# EAGLE design Boot_selector_SMD (EAGLE 7.7.0)
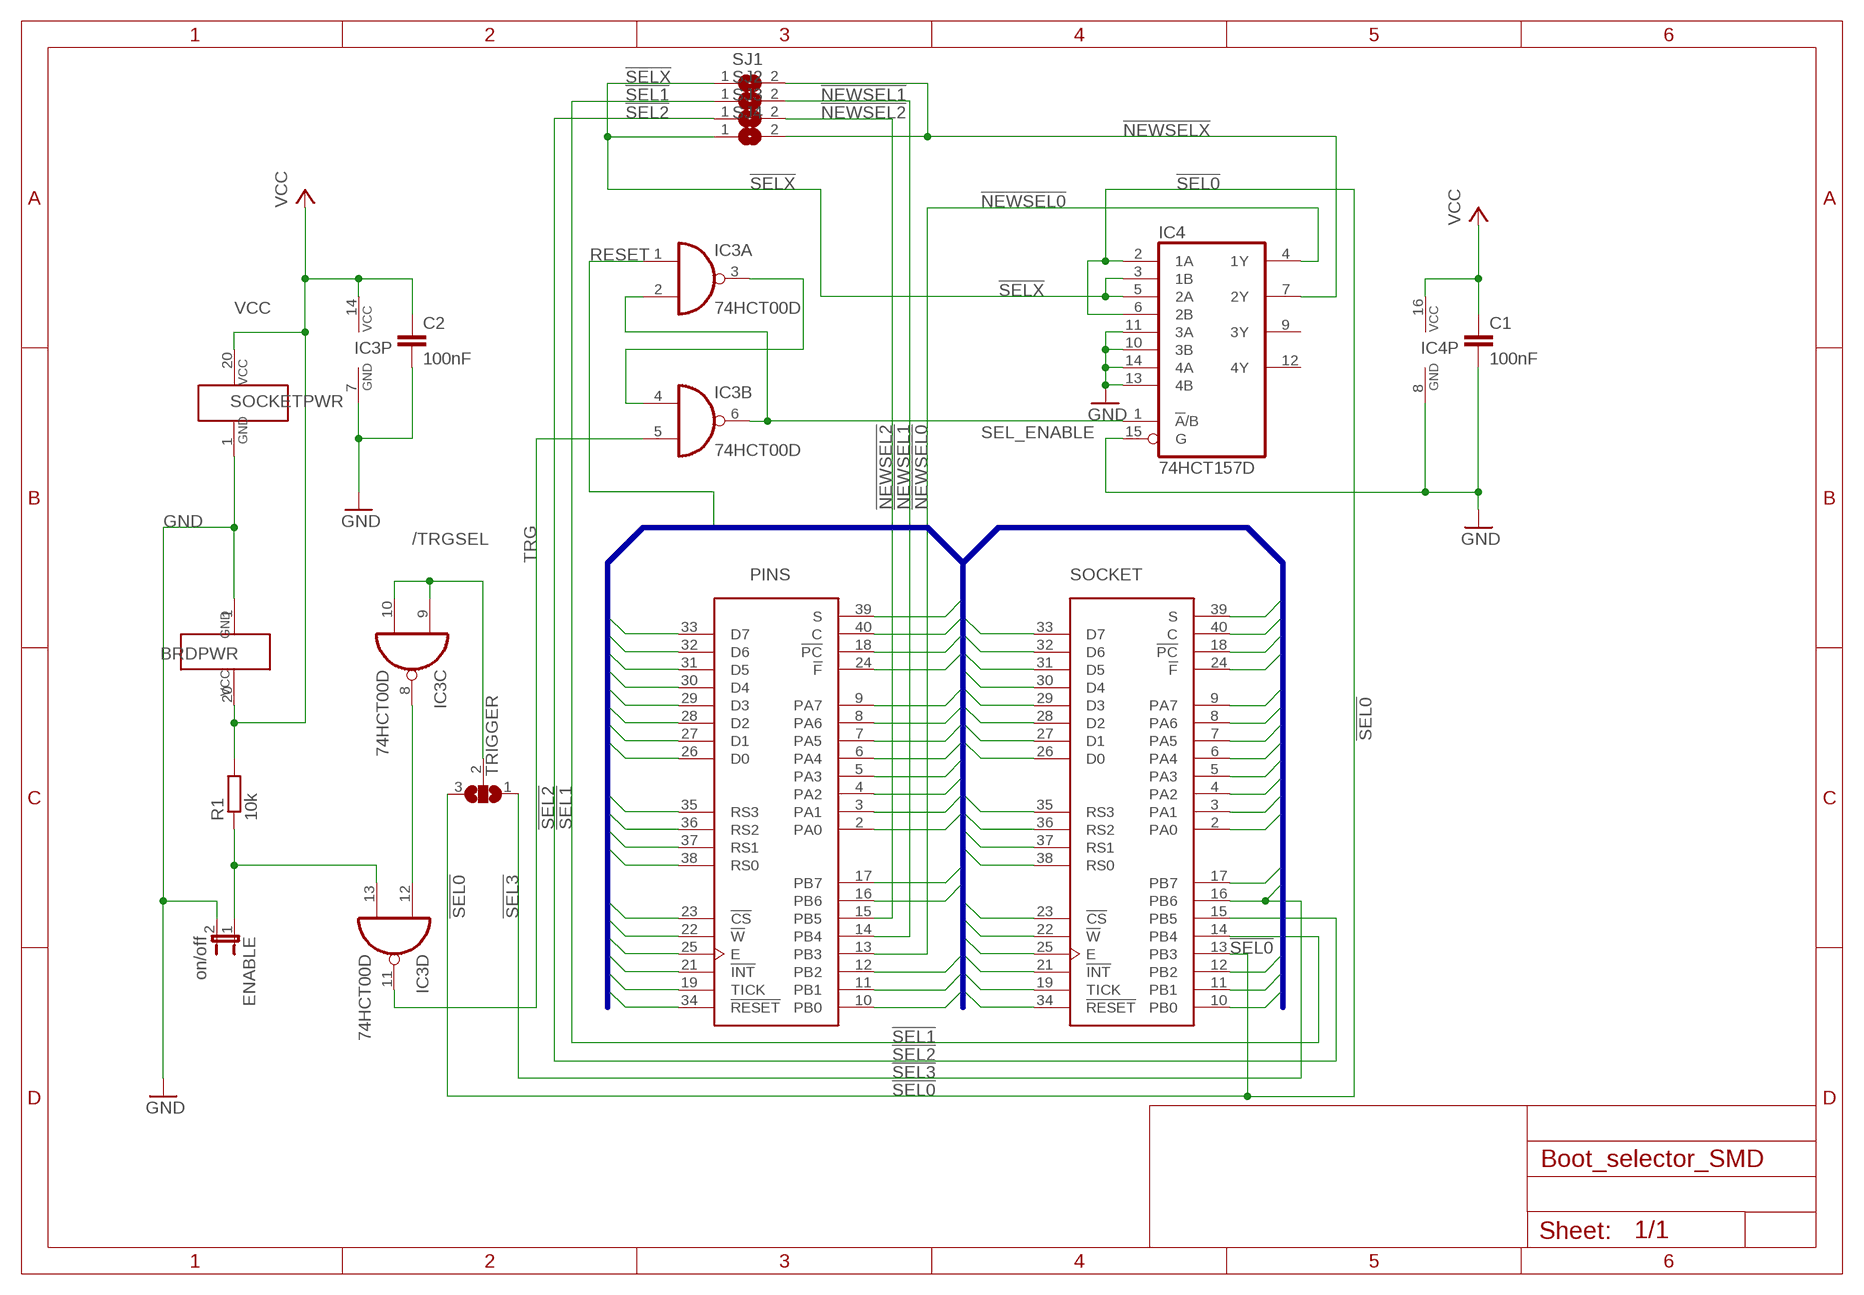
[diagram p0: schematic, sheet 1]

## Parts
BRD  PINS  CIA_DIP  [DIP40-6]
C1  100nF  C-EUC0805  [C0805]
C2  100nF  C-EUC0805K  [C0805K]
ENABLE  on/off  JP1E  [JP1]
IC3  74HCT00D  [SO14]
IC4  74HCT157D  [SO16]
R1  10k  R-EU_R0805  [R0805]
SJ1  SJ  [SJ]
SJ2  SJ  [SJ]
SJ3  SJ  [SJ]
SJ4  SJ  [SJ]
SOCKET  CIA_DIP  [DIP40-6]
TRIGGER  SJ2W  [SJ_2]

## Nets
!NEWSEL0: BRD.13(PB3) IC4.4(1Y)
!NEWSEL1: BRD.14(PB4) SJ2.2
!NEWSEL2: BRD.15(PB5) SJ3.2
!NEWSELX: IC4.7(2Y) SJ1.2 SJ4.2
!SEL0: IC4.2(1A) IC4.6(2B) SOCKET.13(PB3) TRIGGER.3
!SEL1: SJ2.1 SOCKET.14(PB4)
!SEL2: SJ3.1 SOCKET.15(PB5)
!SEL3: BRD.16(PB6) SOCKET.16(PB6) TRIGGER.1
!SELX: IC4.3(1B) IC4.5(2A) SJ1.1 SJ4.1
/TRGSEL: IC3.9(C:I0) IC3.10(C:I1) TRIGGER.2
C: BRD.40(C) SOCKET.40(C)
CS: BRD.23(!CS) SOCKET.23(!CS)
D0: BRD.26(D0) SOCKET.26(D0)
D1: BRD.27(D1) SOCKET.27(D1)
D2: BRD.28(D2) SOCKET.28(D2)
D3: BRD.29(D3) SOCKET.29(D3)
D4: BRD.30(D4) SOCKET.30(D4)
D5: BRD.31(D5) SOCKET.31(D5)
D6: BRD.32(D6) SOCKET.32(D6)
D7: BRD.33(D7) SOCKET.33(D7)
E: BRD.25(E) SOCKET.25(E)
F: BRD.24(!F) SOCKET.24(!F)
GND: BRD.1(GND1) C1.2 C2.2 ENABLE.2 IC3.7(P:GND) IC4.8(GND) IC4.10(3B) IC4.11(3A) IC4.13(4B) IC4.14(4A) IC4.15(G) SOCKET.1(GND1)
INT: BRD.21(!INT) SOCKET.21(!INT)
N$2: ENABLE.1 IC3.13(D:I1) R1.1
N$4: IC3.8(C:O) IC3.12(D:I0)
N$6: IC3.3(A:O) IC3.4(B:I0)
PA0: BRD.2(PA0) SOCKET.2(PA0)
PA1: BRD.3(PA1) SOCKET.3(PA1)
PA2: BRD.4(PA2) SOCKET.4(PA2)
PA3: BRD.5(PA3) SOCKET.5(PA3)
PA4: BRD.6(PA4) SOCKET.6(PA4)
PA5: BRD.7(PA5) SOCKET.7(PA5)
PA6: BRD.8(PA6) SOCKET.8(PA6)
PA7: BRD.9(PA7) SOCKET.9(PA7)
PB0: BRD.10(PB0) SOCKET.10(PB0)
PB1: BRD.11(PB1) SOCKET.11(PB1)
PB2: BRD.12(PB2) SOCKET.12(PB2)
PB7: BRD.17(PB7) SOCKET.17(PB7)
PC: BRD.18(!PC) SOCKET.18(!PC)
RESET: BRD.34(!RESET) IC3.1(A:I0) SOCKET.34(!RESET)
RS0: BRD.38(RS0) SOCKET.38(RS0)
RS1: BRD.37(RS1) SOCKET.37(RS1)
RS2: BRD.36(RS2) SOCKET.36(RS2)
RS3: BRD.35(RS3) SOCKET.35(RS3)
S: BRD.39(S) SOCKET.39(S)
SEL_ENABLE: IC3.2(A:I1) IC3.6(B:O) IC4.1(!A!/B)
TICK: BRD.19(TICK) SOCKET.19(TICK)
TRG: IC3.5(B:I1) IC3.11(D:O)
VCC: BRD.20(VCC1) C1.1 C2.1 IC3.14(P:VCC) IC4.16(VCC) R1.2 SOCKET.20(VCC1)
W: BRD.22(!W) SOCKET.22(!W)
Unconnected: IC4.9(3Y) IC4.12(4Y)

## Buses
!SEL3,D[0..7],PA[0..7],PB[0..2],PB[5..7],F,PC,C,S,RS[0..3],CS,W,E,INT,TICK,RESET

## Library data of the parts
BRD SOCKET = Amiga:CIA
C1 C2 = rcl:C-EU: CAPACITOR, European symbol
ENABLE = jumper:JP1E: JUMPER
IC3 = 74xx-eu:74*00: Quad 2-input NAND gate
IC4 = 74xx-eu:74*157: Quadruple 2-line to 1-line data SELECTOR/MULTIPLEXER
R1 = rcl:R-EU_: RESISTOR, European symbol
SJ1-SJ4 = jumper:SJ: SMD solder JUMPER
TRIGGER = jumper:SJ2W: SMD solder JUMPER

## Board
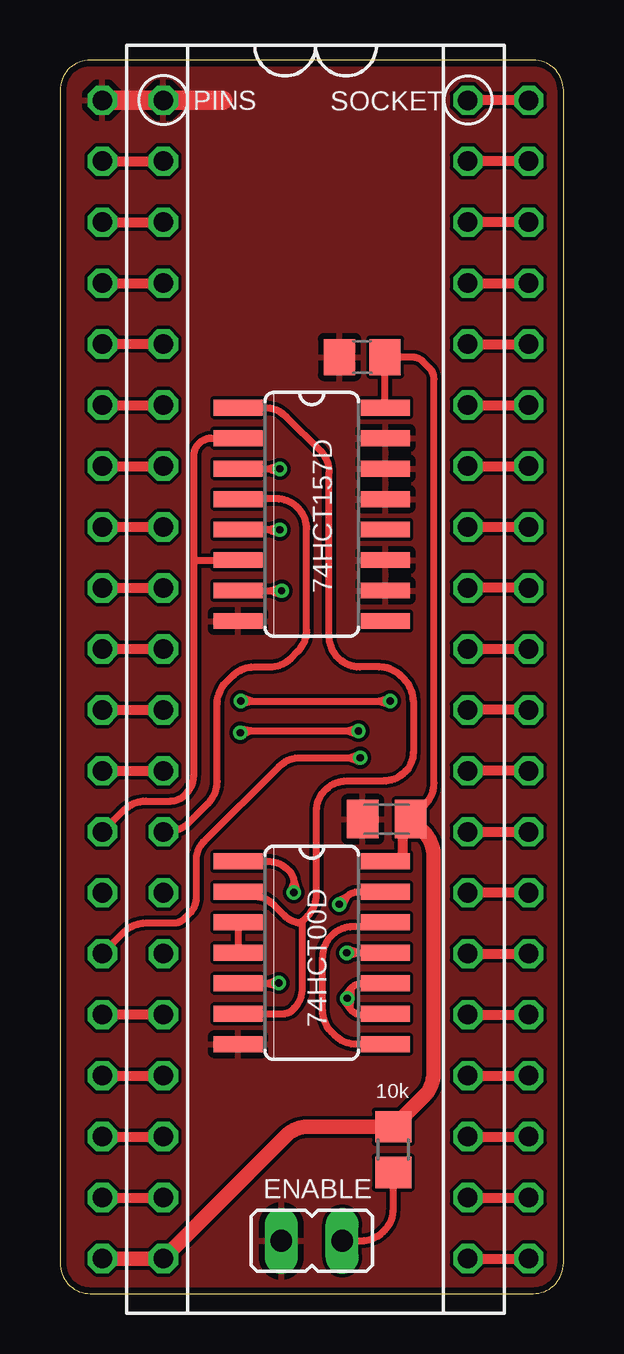
[diagram p1: board, top side]
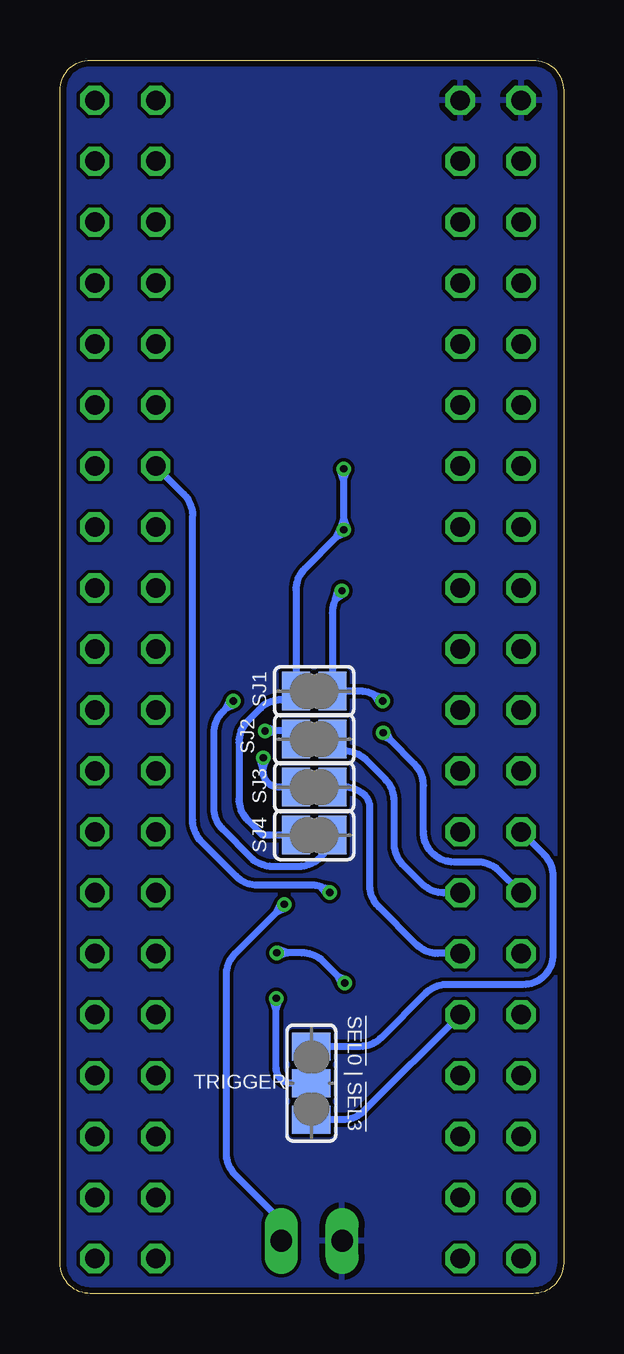
[diagram p2: board, bottom side, seen from below]

Size 21 x 51.4 mm. Coordinates in mm from the lower left corner, seen from the top.
Outline: 0,50.13 0,1.27 arc90 1.27,0 19.73,0 arc90 21,1.27 21,50.13 arc90 19.73,51.4 1.27,51.4 arc90 0,50.13
Copper layers (1*16): Top 0.0356mm / dielectric 1.5011mm / Bottom 0.0356mm
Design rules "Cogra_utvecklarservice *": minimum track width 0.15mm, minimum drill 0.3mm, track to track 0.15mm, track to pad 0.15mm, pad to pad 0.15mm, via to via 0.15mm, smd to smd 0.15mm, copper to edge 10mil, drill to drill 0.5mm, minimum pad ring 0.15mm, minimum via ring 0.15mm, stop-mask expansion 0mil, vias tented up to drill 15mil, thermal gap 10mil

### Footprints (pad centres in the part's own frame; a part is rotated, then mirrored left to right if it is on the bottom)
DIP40-6 = drill 0.813 octagon: 1 -24.13,-7.62; 2 -21.59,-7.62; 3 -19.05,-7.62; 4 -16.51,-7.62; 5 -13.97,-7.62; 6 -11.43,-7.62; 7 -8.89,-7.62; 8 -6.35,-7.62; 9 -3.81,-7.62; 10 -1.27,-7.62; 11 1.27,-7.62; 12 3.81,-7.62; 13 6.35,-7.62; 14 8.89,-7.62; 15 11.43,-7.62; 16 13.97,-7.62; 17 16.51,-7.62; 18 19.05,-7.62; 19 21.59,-7.62; 20 24.13,-7.62; 21 24.13,7.62; 22 21.59,7.62; 23 19.05,7.62; 24 16.51,7.62; 25 13.97,7.62; 26 11.43,7.62; 27 8.89,7.62; 28 6.35,7.62; 29 3.81,7.62; 30 1.27,7.62; 31 -1.27,7.62; 32 -3.81,7.62; 33 -6.35,7.62; 34 -8.89,7.62; 35 -11.43,7.62; 36 -13.97,7.62; 37 -16.51,7.62; 38 -19.05,7.62; 39 -21.59,7.62; 40 -24.13,7.62
C0805 = smd 1.3 x 1.5: 1 -0.95,0; 2 0.95,0
C0805K = smd 1.3 x 1.6: 1 -1,0; 2 1,0
JP1 = drill 0.914 long: 1 0,-1.27; 2 0,1.27
SO14 = smd 0.66 x 2.032: 1 -3.81,-3.073; 2 -2.54,-3.073; 3 -1.27,-3.073; 4 0,-3.073; 5 1.27,-3.073; 6 2.54,-3.073; 7 3.81,-3.073; 8 3.81,3.073; 9 2.54,3.073; 10 1.27,3.073; 11 0,3.073; 12 -1.27,3.073; 13 -2.54,3.073; 14 -3.81,3.073
SO16 = smd 0.66 x 2.032: 1 -4.445,-3.073; 2 -3.175,-3.073; 3 -1.905,-3.073; 4 -0.635,-3.073; 5 0.635,-3.073; 6 1.905,-3.073; 7 3.175,-3.073; 8 4.445,-3.073; 9 4.445,3.073; 10 3.175,3.073; 11 1.905,3.073; 12 0.635,3.073; 13 -0.635,3.073; 14 -1.905,3.073; 15 -3.175,3.073; 16 -4.445,3.073
R0805 = smd 1.3 x 1.5: 1 -0.95,0; 2 0.95,0
SJ = smd 1.168 x 1.6: 1 -0.762,0; 2 0.762,0
SJ_2 = smd 1.168 x 1.6: 1 -1.524,0; 2 0,0; 3 1.524,0

### Placement (x,y rotation side)
BRD  11.93,25.59 270 top
C1  12.61,39.02 180 top
C2  13.62,19.77 180 top
ENABLE  10.5,2.2 90 top
IC3  10.5,14.2 270 top
IC4  10.5,32.47 270 top
R1  13.9,6 90 top
SJ1  10.4,25.1 0 bottom
SJ2  10.4,23.1 0 bottom
SJ3  10.4,21.1 0 bottom
SJ4  10.4,19.1 0 bottom
SOCKET  9.39,25.59 270 top
TRIGGER  10.52,8.77 90 bottom

### Tracks (layer width: path | path; a pad name or v marks a point on that pad's centre or on a via)
!NEWSEL0
  Top 0.3: IC4.4 7.44,33.12 9.02,33.12 arc-90 10.29,31.85 10.29,27.65 arc-45 9.91,26.75 9.64,26.48 arc-45 8.74,26.11 8.1,26.11 arc45 7.2,25.74 6.92,25.47 arc45 6.55,24.57 6.55,21.33 arc-45 6.18,20.43 5.37,19.61 arc-45 4.47,19.24 BRD.13
!NEWSEL1
  Bottom 0.3: BRD.14 5,16.7 arc45 5.9,17.07 6.69,17.86 arc45 7.06,18.76 7.06,20.53 arc-45 7.43,21.43 8.24,22.23 arc-45 9.14,22.61 SJ2.2
!NEWSEL2
  Bottom 0.3: BRD.15 4.32,14.17 5.24,14.17 arc45 6.14,14.54 7.71,16.11 arc45 8.08,17.01 8.08,20.28 arc-45 8.26,20.73 arc-45 9.16,21.11 SJ3.2
!NEWSELX  (via drill 0.3)
  Top 0.3: IC4.7 8.8,29.3 | 8.8,29.3 9.24,29.3 v9.25,29.29 | v7.54,24.69 7.99,24.69 | 7.99,24.69 13.32,24.69 | 13.32,24.69 v13.77,24.69 | 8.8,29.3 9.19,29.15 v9.25,29.29 | 8.8,29.3 9.2,29.43 v9.25,29.29 | 13.32,24.69 13.72,24.55 v13.77,24.69 | 13.32,24.69 13.72,24.83 v13.77,24.69 | 7.99,24.69 7.59,24.83 v7.54,24.69 | 7.99,24.69 7.59,24.55 v7.54,24.69
  Bottom 0.3: SJ1.2 | v9.25,29.29 9.27,29.27 arc-45 9.64,28.37 SJ1.2 | 14.09,24.37 14.21,24.25 arc-45 14.58,23.35 14.58,20.24 arc-45 14.21,19.34 13.05,18.18 arc-45 12.15,17.8 11.04,17.8 arc-45 10.14,18.18 10.01,18.31 10.01,18.73 SJ4.2 | 14.09,24.37 v13.77,24.69 | v7.54,24.69 7.58,24.73 arc-45 8.48,25.1 SJ1.2 | v9.25,29.29 9.39,29.33 9.51,28.92 9.16,29.16 v9.25,29.29 | 14.09,24.37 13.9,24.75 v13.77,24.69 | 14.09,24.37 13.7,24.55 v13.77,24.69 | v7.54,24.69 7.5,24.83 7.9,24.96 7.67,24.61 v7.54,24.69
!SEL0
  Top 0.3: SOCKET.13 2.68,20.15 arc-45 3.58,20.52 4.61,20.52 arc44 5.2,20.76 arc46 5.59,21.67 5.59,30.53 | 5.59,30.53 5.59,34.94 arc-45 5.77,35.39 5.84,35.46 arc-45 6.29,35.65 IC4.2 | IC4.6 7.39,30.53 5.59,30.53
  Bottom 0.3: TRIGGER.3 8.49,10.29 arc-45 7.6,10.67 5.76,12.51 arc45 4.86,12.88 1.68,12.88 arc-45 0.8,13.24 arc-45 0.43,14.14 0.43,17.38 arc-45 0.8,18.28 SOCKET.13
!SEL1  (via drill 0.3)
  Top 0.3: v7.52,23.37 7.59,23.44 7.96,23.44 | 7.96,23.44 12,23.44 | 12,23.44 v12.45,23.44 | 12,23.44 12.4,23.3 v12.45,23.44 | 12,23.44 12.4,23.59 v12.45,23.44 | 7.96,23.44 7.54,23.52 v7.52,23.37 | 7.96,23.44 7.59,23.24 v7.52,23.37
  Bottom 0.3: SOCKET.14 2.71,17.62 arc-44 3.6,17.98 4.57,17.98 arc90 5.84,19.25 5.84,21.17 arc-45 6.21,22.06 7.2,23.05 | 7.2,23.05 v7.52,23.37 | SJ2.1 11.16,23.44 12,23.44 | 12,23.44 v12.45,23.44 | 12,23.44 12.4,23.3 v12.45,23.44 | 12,23.44 12.4,23.59 v12.45,23.44 | 7.2,23.05 7.58,23.23 v7.52,23.37 | 7.2,23.05 7.38,23.43 v7.52,23.37
!SEL2  (via drill 0.3)
  Top 0.3: SOCKET.15 2.68,15.07 arc-45 3.58,15.44 4.78,15.44 arc45 5.22,15.66 5.47,15.91 arc45 5.69,16.63 5.69,18.09 arc-45 6.01,18.84 9.13,21.95 arc-45 10.03,22.33 12.07,22.33 | 12.07,22.33 v12.52,22.33 | 12.07,22.33 12.47,22.18 v12.52,22.33 | 12.07,22.33 12.47,22.47 v12.52,22.33
  Bottom 0.3: SJ3.1 11.89,21.1 arc90 12.52,21.73 12.52,21.88 | 12.52,21.88 v12.52,22.33 | 12.52,21.88 12.66,22.28 v12.52,22.33 | 12.52,21.88 12.38,22.28 v12.52,22.33
!SEL3
  Top 0.406: BRD.16 SOCKET.16
  Bottom 0.3: BRD.16 8.31,7.62 arc45 9.21,7.25 TRIGGER.1
!SELX  (via drill 0.3)
  Top 0.3: IC4.3 8.72,34.38 | 8.72,34.38 v9.16,34.38 v9.17,34.37 | v9.17,31.83 8.72,31.83 | 8.72,31.83 IC4.5 | 8.72,34.38 9.12,34.23 v9.17,34.37 | 8.72,34.38 9.12,34.51 v9.17,34.37 | 8.72,31.83 9.12,31.68 v9.17,31.83 | 8.72,31.83 9.12,31.97 v9.17,31.83
  Bottom 0.3: SJ4.1 12.55,19.1 13.17,19.72 arc45 13.54,20.62 13.54,22.97 arc45 13.17,23.87 12.67,24.37 arc45 11.77,24.74 11.58,24.74 11.22,25.1 SJ1.1 11.16,29.31 arc45 10.79,30.21 9.49,31.51 | v9.17,34.37 9.17,33.92 | 9.17,33.92 9.17,32.28 | 9.17,32.28 v9.17,31.83 | v9.17,31.83 9.49,31.51 | 9.17,33.92 9.31,34.32 v9.17,34.37 | 9.17,33.92 9.03,34.32 v9.17,34.37 | 9.17,32.28 9.03,31.88 v9.17,31.83 | 9.17,32.28 9.31,31.88 v9.17,31.83 | 9.49,31.51 9.3,31.89 v9.17,31.83 | 9.49,31.51 9.11,31.69 v9.17,31.83
/TRGSEL  (via drill 0.3)
  Top 0.3: IC3.9 13.51,11.6 12.62,11.6 arc-55 12.11,11.87 | v11.98,12.3 arc-90 12.61,12.93 IC3.10 | 12.11,11.87 arc-35 11.99,12.23 11.99,12.29 v11.98,12.3 | v11.98,12.3 11.86,12.4 12.14,12.72 12.13,12.3 v11.98,12.3 | 12.11,11.87 12.13,12.29 v11.98,12.3 | 12.11,11.87 11.86,12.21 v11.98,12.3
  Bottom 0.3: TRIGGER.2 11.35,8.77 arc90 11.99,9.4 11.99,11.85 | 11.99,11.85 11.99,12.29 v11.98,12.3 | 11.99,11.85 12.12,12.25 v11.98,12.3 | 11.99,11.85 11.84,12.25 v11.98,12.3
C
  Top 0.406: BRD.40 SOCKET.40
CS
  Top 0.406: SOCKET.23 BRD.23
D0
  Top 0.406: SOCKET.26 BRD.26
D1
  Top 0.406: SOCKET.27 17.5,16.7 19.5,16.7 BRD.27
D2
  Top 0.406: BRD.28 19.5,19.2 19.46,19.24 SOCKET.28
D3
  Top 0.406: BRD.29 SOCKET.29
D4
  Top 0.406: BRD.30 SOCKET.30
D5
  Top 0.406: SOCKET.31 BRD.31
D6
  Top 0.406: BRD.32 SOCKET.32
D7
  Top 0.406: SOCKET.33 BRD.33
E
  Top 0.406: SOCKET.25 BRD.25
F
  Top 0.406: SOCKET.24 BRD.24
GND
  Top 0.813: SOCKET.1 BRD.1 6.79,49.72
  pour Top: -0.3,52.3 22.1,52.3 22.1,-0.8 -0.3,-0.8
  pour Bottom: 21.4,51.8 -1,51.8 -1,-1.3 21.4,-1.3
INT
  Top 0.406: SOCKET.21 BRD.21
N$2  (via drill 0.3)
  Top 0.3: ENABLE.1 12.57,2.2 arc45 13.47,2.57 13.53,2.63 arc45 13.9,3.53 R1.1 13.75,5.2 | 13.53,16.7 IC3.13 12.43,16.74 arc45 11.98,16.55 11.96,16.54 | v11.65,16.22 11.96,16.54 | 11.96,16.54 11.58,16.35 v11.65,16.22 | 11.96,16.54 11.78,16.15 v11.65,16.22
  Bottom 0.3: v11.65,16.22 11.96,15.9 | 11.96,15.9 13.7,14.16 arc-45 14.07,13.27 14.07,5.86 arc-45 13.7,4.96 11.76,3.02 ENABLE.1 | 11.96,15.9 11.78,16.28 v11.65,16.22 | 11.96,15.9 11.58,16.08 v11.65,16.22
N$4
  Top 0.3: IC3.8 12.36,10.39 arc-45 11.46,10.76 11.32,10.9 arc-45 10.95,11.8 10.95,14.02 arc-90 12.22,15.29 13.33,15.29 13.54,15.5 IC3.12
N$6
  Top 0.3: IC3.3 IC3.4
PA0
  Top 0.406: SOCKET.2 BRD.2
PA1
  Top 0.406: SOCKET.3 BRD.3
PA2
  Top 0.406: SOCKET.4 BRD.4
PA3
  Top 0.406: BRD.5 SOCKET.5
PA4
  Top 0.406: SOCKET.6 BRD.6
PA5
  Top 0.406: SOCKET.7 BRD.7
PA6
  Top 0.406: SOCKET.8 BRD.8
PA7
  Top 0.406: SOCKET.9 BRD.9
PB0
  Top 0.406: SOCKET.10 BRD.10
PB1
  Top 0.406: SOCKET.11 BRD.11
PB2
  Top 0.406: SOCKET.12 BRD.12
PB7
  Top 0.406: SOCKET.17 BRD.17
PC
  Top 0.406: SOCKET.18 BRD.18
RESET  (via drill 0.3)
  Top 0.3: IC3.1 8.64,18.01 arc-45 9.54,17.64 arc-42 9.75,17.16 | 9.75,17.16 arc-3 9.75,17.12 v9.75,16.71 | 9.75,17.16 9.61,16.76 v9.75,16.71 | 9.75,17.16 9.89,16.76 v9.75,16.71
  Top 0.406: SOCKET.34 BRD.34
  Bottom 0.3: SOCKET.34 15.84,33.31 arc45 15.47,32.41 15.47,19.73 arc-45 15.1,18.83 13.66,17.39 arc-45 12.76,17.02 10.49,17.02 arc20 10.13,16.95 | v9.75,16.71 arc-25 10.13,16.95 | 10.13,16.95 9.72,16.86 v9.75,16.71 | 10.13,16.95 9.87,16.62 v9.75,16.71
RS0
  Top 0.406: BRD.38 SOCKET.38
RS1
  Top 0.406: SOCKET.37 BRD.37
RS2
  Top 0.406: SOCKET.36 BRD.36
RS3
  Top 0.406: SOCKET.35 BRD.35
S
  Top 0.406: BRD.39 SOCKET.39
SEL_ENABLE
  Top 0.3: IC4.1 8.53,36.91 arc-45 9.43,36.54 10.86,35.12 arc-45 11.23,34.22 11.23,27.38 arc90 12.5,26.11 13.32,26.11 arc-45 14.21,25.74 14.36,25.59 arc-45 14.73,24.7 14.73,22.55 arc-45 14.39,21.73 arc-45 13.49,21.36 11.96,21.36 arc90 10.69,20.09 10.69,16.63 arc-45 10.32,15.73 10.11,15.52 10.11,15.44 | IC3.2 7.61,16.56 8.03,16.56 arc-45 8.93,16.19 9.37,15.75 arc45 10.11,15.44 | IC3.6 9.29,11.66 arc45 9.74,11.85 arc45 10.11,12.74 10.11,15.44
TICK
  Top 0.406: SOCKET.19 BRD.19
TRG  (via drill 0.3)
  Top 0.3: IC3.5 8.67,12.93 | 8.67,12.93 9.19,12.93 v9.12,12.94 | v11.96,14.2 12.41,14.2 | 12.41,14.2 IC3.11 | 8.67,12.93 9.08,12.8 v9.12,12.94 | 8.67,12.93 9.07,13.08 v9.12,12.94 | 12.41,14.2 12.01,14.34 v11.96,14.2 | 12.41,14.2 12.01,14.06 v11.96,14.2
  Bottom 0.3: v9.12,12.94 9.44,13.26 | 9.44,13.26 10.01,13.83 arc-45 10.91,14.2 11.51,14.2 | 11.51,14.2 v11.96,14.2 | 9.44,13.26 9.06,13.07 v9.12,12.94 | 9.44,13.26 9.26,12.88 v9.12,12.94 | 11.51,14.2 11.91,14.06 v11.96,14.2 | 11.51,14.2 11.91,14.34 v11.96,14.2
VCC
  Top 0.3: 13.61,36.88 IC4.16 13.56,36.93 C1.1 14.69,39.02 arc-45 15.14,38.84 15.41,38.56 arc-45 15.6,38.12 15.6,21.27 arc-45 15.22,20.37 C2.1
  Top 0.406: IC3.14 14.3,18.01 14.3,19.36 14.62,19.36 C2.1
  Top 0.61: SOCKET.20 BRD.20 9.43,6.58 arc-45 10.32,6.95 R1.2 15.2,8.25 arc45 15.57,9.15 15.57,18.3 arc45 15.2,19.19 C2.1 14.55,19.7
W
  Top 0.406: SOCKET.22 BRD.22

### Text on the board
tPlace: SOCKET | PINS
bNames: !SEL0! | !SEL3